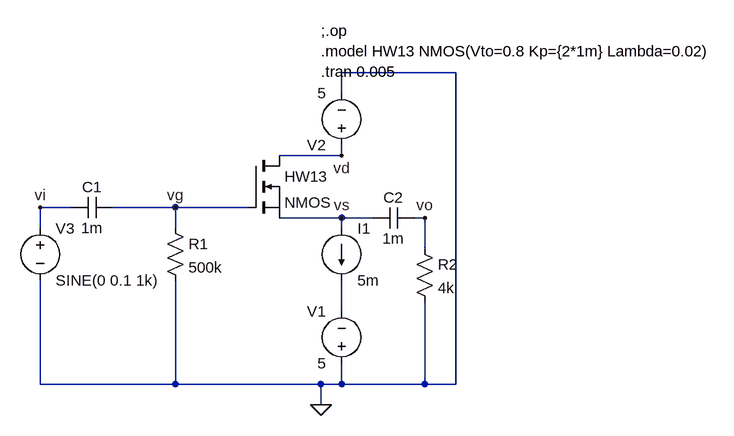
[diagram p0: schematic HW13_Alternate.asc]
HW13_Alternate.asc, the LTspice schematic file:
Version 4
SHEET 1 908 680
WIRE 448 -112 272 -112
WIRE 272 -80 272 -112
WIRE 272 16 272 0
WIRE 272 16 176 16
WIRE -144 96 -192 96
WIRE 16 96 -80 96
WIRE 128 96 16 96
WIRE 272 112 176 112
WIRE 320 112 272 112
WIRE 400 112 384 112
WIRE -192 128 -192 96
WIRE 16 128 16 96
WIRE 272 128 272 112
WIRE 400 160 400 112
WIRE 272 256 272 208
WIRE -192 368 -192 208
WIRE 16 368 16 208
WIRE 16 368 -192 368
WIRE 240 368 16 368
WIRE 272 368 272 336
WIRE 272 368 240 368
WIRE 400 368 400 240
WIRE 400 368 272 368
WIRE 448 368 448 -112
WIRE 448 368 400 368
WIRE 240 400 240 368
FLAG 240 400 0
FLAG 272 16 vd
FLAG 272 112 vs
FLAG 16 96 vg
FLAG -192 96 vi
FLAG 400 112 vo
SYMBOL res 0 112 R0
SYMATTR InstName R1
SYMATTR Value 500k
SYMBOL current 272 128 R0
WINDOW 123 0 0 Left 0
WINDOW 39 0 0 Left 0
SYMATTR InstName I1
SYMATTR Value 5m
SYMBOL voltage 272 352 R180
WINDOW 0 24 96 Left 2
WINDOW 3 24 16 Left 2
WINDOW 123 0 0 Left 0
WINDOW 39 0 0 Left 0
SYMATTR InstName V1
SYMATTR Value 5
SYMBOL voltage 272 16 R180
WINDOW 123 0 0 Left 0
WINDOW 39 0 0 Left 0
SYMATTR InstName V2
SYMATTR Value 5
SYMBOL nmos 128 16 R0
SYMATTR InstName HW13
SYMBOL cap -144 112 R270
WINDOW 0 32 32 VTop 2
WINDOW 3 0 32 VBottom 2
SYMATTR InstName C1
SYMATTR Value 1m
SYMBOL cap 320 128 R270
WINDOW 0 32 32 VTop 2
WINDOW 3 0 32 VBottom 2
SYMATTR InstName C2
SYMATTR Value 1m
SYMBOL res 384 144 R0
SYMATTR InstName R2
SYMATTR Value 4k
SYMBOL voltage -192 112 R0
WINDOW 123 0 0 Left 0
WINDOW 39 0 0 Left 0
SYMATTR InstName V3
SYMATTR Value SINE(0 0.1 1k)
TEXT 240 -176 Left 2 !;.op\n.model HW13 NMOS(Vto=0.8 Kp={2*1m} Lambda=0.02)\n.tran 0.005

The netlist it stands for:
* HW13_Alternate.asc
R1 vg 0 500k
I1 vs N001 5m
V1 0 N001 5
V2 vd 0 5
M§HW13 vd vg vs vs NMOS
C1 vi vg 1m
C2 vs vo 1m
R2 vo 0 4k
V3 vi 0 SINE(0 0.1 1k)
.model NMOS NMOS
.model PMOS PMOS
.lib standard.mos
;.op
.model HW13 NMOS(Vto=0.8 Kp={2*1m} Lambda=0.02)
.tran 0.005
.backanno
.end